# Altium schematic sheet 34_PP1_JTAG, PCIe.SchDoc
size 419 x 296 mm; Author: Serbinov O.A.; CompanyName: ELSICOM; DrawnBy: Serbinov O.A.; Engineer: Serbinov O.A.; Organization: Elsicom; Address1: Kirova avenue, 58; Address2: Tomsk; Address3: Russia 634012; DocumentNumber: 35; SheetNumber: 35; SheetTotal: 44; ProjectName: 48_PORTS
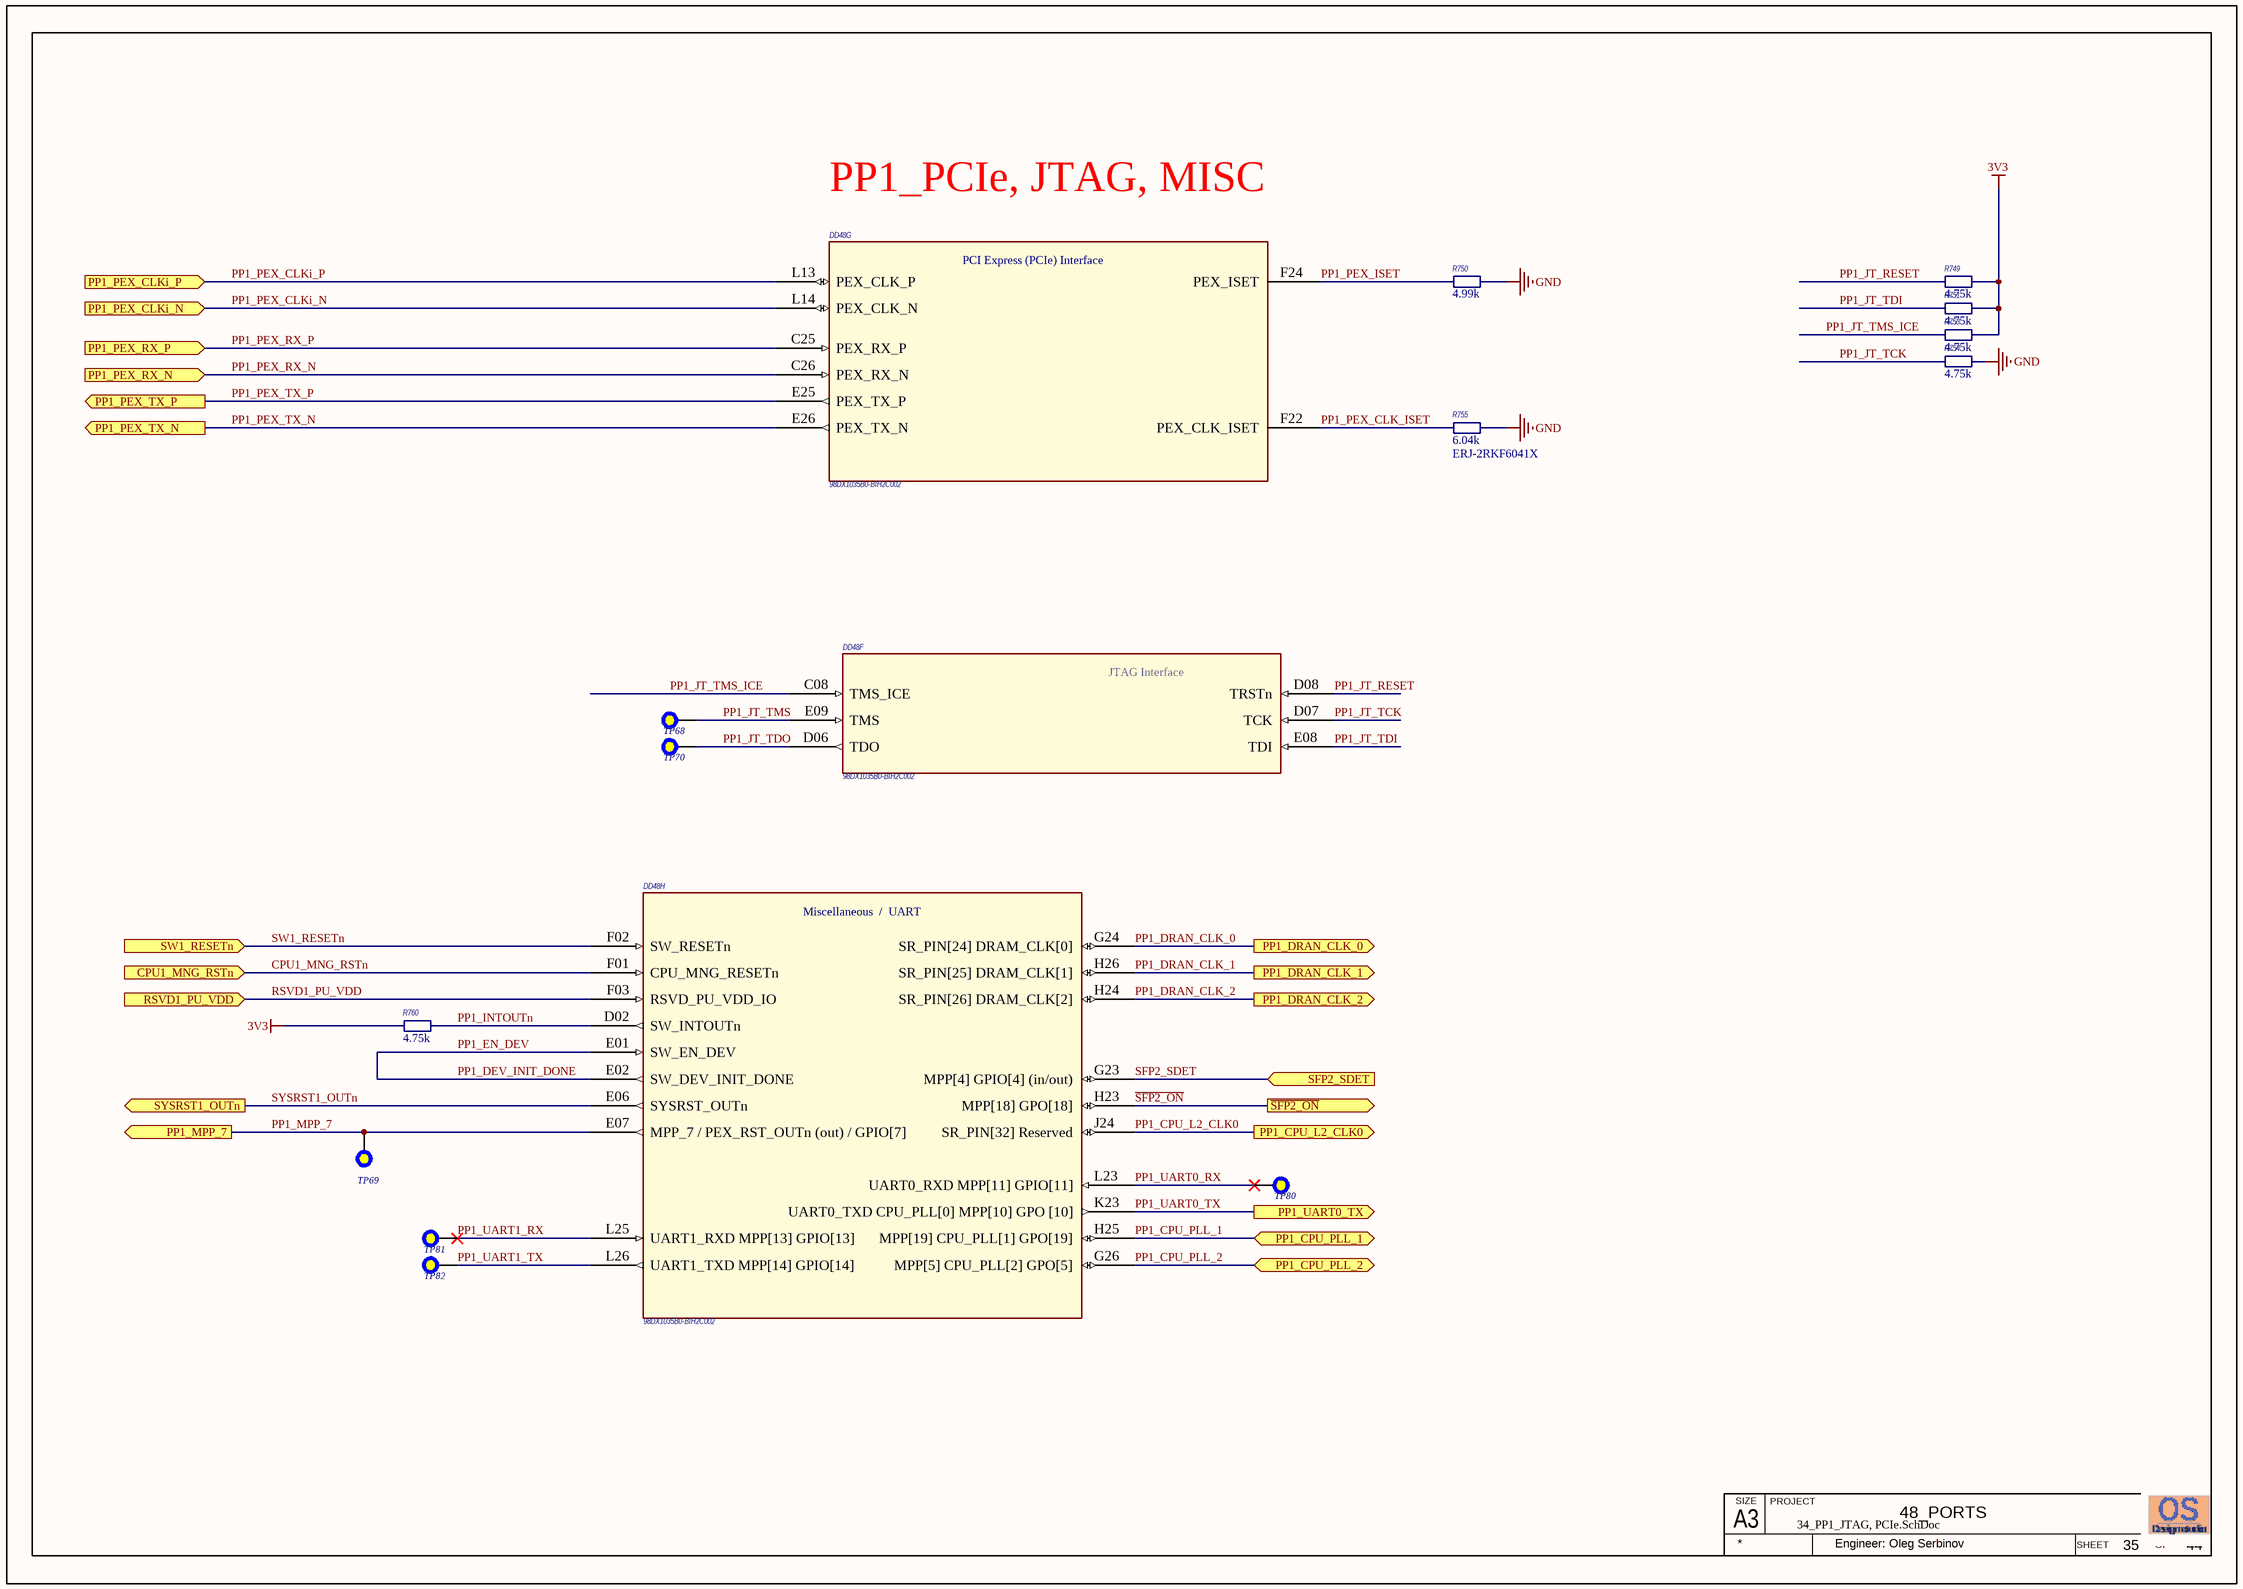
[diagram p0: 34_PP1_JTAG, PCIe.SchDoc]

## Parts
DD48  98DX1035B0-BIH2C002  [HSBGA617_27X27_1MM]  (parts F,G,H of 16)
R749  Resistance (Ohms): 4.75k  [R0402_IPC High Density]  (hidden comment: ERJ-2RKF4751X)
R750  Resistance (Ohms): 4.99k  [R0402_IPC High Density]  (hidden comment: ERJ-2RKF4991X)
R751  Resistance (Ohms): 4.75k  [R0402_IPC High Density]  (hidden comment: ERJ-2RKF4751X)
R753  Resistance (Ohms): 4.75k  [R0402_IPC High Density]  (hidden comment: ERJ-2RKF4751X)
R754  Resistance (Ohms): 4.75k  [R0402_IPC High Density]  (hidden comment: ERJ-2RKF4751X)
R755  Resistance (Ohms): 6.04k  [R0402_IPC High Density]  (hidden comment: ERJ-2RKF6041X)
R760  Resistance (Ohms): 4.75k  [R0402_IPC High Density]  (hidden comment: ERJ-2RKF4751X)
TP68  Test Point 0.5mm pad  [Test Point 0.5mm]  (value not drawn)  (no BOM)
TP69  Test Point 0.5mm pad  [Test Point 0.5mm]  (value not drawn)  (no BOM)
TP70  Test Point 0.5mm pad  [Test Point 0.5mm]  (value not drawn)  (no BOM)
TP80  Test Point 0.5mm pad  [Test Point 0.5mm]  (value not drawn)  (no BOM)
TP81  Test Point 0.5mm pad  [Test Point 0.5mm]  (value not drawn)  (no BOM)
TP82  Test Point 0.5mm pad  [Test Point 0.5mm]  (value not drawn)  (no BOM)

## Ports
CPU1_MNG_RSTn (in), PP1_CPU_L2_CLK0 (out), PP1_CPU_PLL_1 (bidir), PP1_CPU_PLL_2 (bidir), PP1_DRAN_CLK_0 (out), PP1_DRAN_CLK_1 (out), PP1_DRAN_CLK_2 (out), PP1_MPP_7 (out), PP1_PEX_CLKi_N (in), PP1_PEX_CLKi_P (in), PP1_PEX_RX_N (in), PP1_PEX_RX_P (in), PP1_PEX_TX_N (out), PP1_PEX_TX_P (out), PP1_UART0_TX (out), RSVD1_PU_VDD (in), SFP2_SDET (in), SW1_RESETn (in), SYSRST1_OUTn (out), ~{SFP2_ON} (out)

## Nets
3V3: R749.2 R751.2 R753.2 R760.1
GND: R750.2 R754.2 R755.2
~{SFP2_ON}: DD48.H23(MPP[18]_GPO[18]) ; port ~{SFP2_ON}
CPU1_MNG_RSTn: DD48.F01(CPU_MNG_RESETn) ; port CPU1_MNG_RSTn
PP1_CPU_L2_CLK0: DD48.J24(SR_PIN[32]_Reserved) ; port PP1_CPU_L2_CLK0
PP1_CPU_PLL_1: DD48.H25(MPP[19]_CPU_PLL[1]_GPO[19]) ; port PP1_CPU_PLL_1
PP1_CPU_PLL_2: DD48.G26(MPP[5]_CPU_PLL[2]_GPO[5]) ; port PP1_CPU_PLL_2
PP1_DEV_INIT_DONE: DD48.E01(SW_EN_DEV) DD48.E02(SW_DEV_INIT_DONE)  [also labelled PP1_EN_DEV]
PP1_DRAN_CLK_0: DD48.G24(SR_PIN[24]_DRAM_CLK[0]) ; port PP1_DRAN_CLK_0
PP1_DRAN_CLK_1: DD48.H26(SR_PIN[25]_DRAM_CLK[1]) ; port PP1_DRAN_CLK_1
PP1_DRAN_CLK_2: DD48.H24(SR_PIN[26]_DRAM_CLK[2]) ; port PP1_DRAN_CLK_2
PP1_INTOUTn: DD48.D02(SW_INTOUTn) R760.2
PP1_JT_RESET: DD48.D08(TRSTn) R749.1
PP1_JT_TCK: DD48.D07(TCK) R754.1
PP1_JT_TDI: DD48.E08(TDI) R751.1
PP1_JT_TDO: DD48.D06(TDO) TP70.1
PP1_JT_TMS: DD48.E09(TMS) TP68.1
PP1_JT_TMS_ICE: DD48.C08(TMS_ICE) R753.1
PP1_MPP_7: DD48.E07(MPP_7_/_PEX_RST_OUTn_(out)_/_GPIO[7]) TP69.1 ; port PP1_MPP_7
PP1_PEX_CLK_ISET: DD48.F22(PEX_CLK_ISET) R755.1
PP1_PEX_CLKi_N: DD48.L14(PEX_CLK_N) ; port PP1_PEX_CLKi_N
PP1_PEX_CLKi_P: DD48.L13(PEX_CLK_P) ; port PP1_PEX_CLKi_P
PP1_PEX_ISET: DD48.F24(PEX_ISET) R750.1
PP1_PEX_RX_N: DD48.C26(PEX_RX_N) ; port PP1_PEX_RX_N
PP1_PEX_RX_P: DD48.C25(PEX_RX_P) ; port PP1_PEX_RX_P
PP1_PEX_TX_N: DD48.E26(PEX_TX_N) ; port PP1_PEX_TX_N
PP1_PEX_TX_P: DD48.E25(PEX_TX_P) ; port PP1_PEX_TX_P
PP1_UART0_RX: DD48.L23(UART0_RXD_MPP[11]_GPIO[11]) TP80.1
PP1_UART0_TX: DD48.K23(UART0_TXD_CPU_PLL[0]_MPP[10]_GPO_[10]) ; port PP1_UART0_TX
PP1_UART1_RX: DD48.L25(UART1_RXD_MPP[13]_GPIO[13]) TP81.1
PP1_UART1_TX: DD48.L26(UART1_TXD_MPP[14]_GPIO[14]) TP82.1
RSVD1_PU_VDD: DD48.F03(RSVD_PU_VDD_IO) ; port RSVD1_PU_VDD
SFP2_SDET: DD48.G23(MPP[4]_GPIO[4]_(in/out)) ; port SFP2_SDET
SW1_RESETn: DD48.F02(SW_RESETn) ; port SW1_RESETn
SYSRST1_OUTn: DD48.E06(SYSRST_OUTn) ; port SYSRST1_OUTn

## Notes on the sheet
- PP1_PCIe, JTAG, MISC
- A3
- SIZE
- PROJECT
- SHEET
- OF
- Engineer: Oleg Serbinov
- (in symbol 98DX1035A1-BIH2C002, part F) JTAG Interface
- (in symbol 98DX1035A1-BIH2C002, part G) PCI Express (PCIe) Interface
- (in symbol 98DX1035A1-BIH2C002, part H) Miscellaneous  /  UART

## Library data of the parts
DD48 = 98DX1035A1-BIH2C002: IC 24-PORT FE  4-PORT 2.5GE L2 ENTRY-LEVEL, CPU; Customer Part Number: Микросхема, 98DX1035B0-BIH2C002, IC 24-PORT FE 4-PORT 2.5GE L2 ENTRY-LEVEL, HSBGA617SBGA617; Manufacturer: Marvell Technology Group; Manufacturer Part Number: 98DX1035B0-BIH2C002
R749 R751 R753 R754 R760 = ERJ-2RKF4751X: R0402, 4.75k 1%; Manufacturer: Panasonic; Rpart number: RC0402FR-074K75L ; RC1005F4751CS ; RMCF0402FT4K75 ; CRCW04024K75FKED ; TRR01MZPF4751; Rmanufacturer: Yageo  Samsung  Stackpole Electronics  Rohm Semiconductor  Vishay Dale; Customer Part Number: Резистор, 4K75, 0402, 1%; Temperature Coefficient: ±100ppm/°C; Power (Watts): 0.1W, 1/10W; Analogs: any suitable; Tolerance: ±1%; Packaging: Cut Tape (CT); Package / Case: 0402 (1005 Metric); Category: Resistors; Manufacturer Part Number: ERJ-2RKF4751X; Supplier Part Number: P4.75KLCT-ND; RoHS: RoHS Compliant; Supplier: Digi-Key; ComponentLink1URL: http://industrial.panasonic.com/www-cgi/jvcr13pz.cgi?E+PZ+3+AOA0002+ERJ2RKF4751X+7+WW; ComponentLink1Description: http://industrial.panasonic.com/www-cgi/jvcr13pz.cgi?E+PZ+3+AOA0002+ERJ2RKF4751X+7+WW; Features: -; Composition: Thick Film; Height: 0.016" (0.40mm); Number of Terminations: 2; Supplier Device Package: 0402; Size / Dimension: 0.039" L x 0.020" W (1.00mm x 0.50mm)
R750 = ERJ-2RKF4991X: R0402, 4.99k 1%; Manufacturer: Panasonic; Customer Part Number: Резистор, 4K99, 0402, 1%; Description 1: RES 4.99K OHM 1/10W 1% 0402 SMD; Category 1: Resistors; Power (Watts): 0.1W, 1/10W; Temperature Coefficient: ±100ppm/°C; Analogs: any suitable; Supplier 1: Digi-Key; Supplier Part Number 1: P4.99KLTR-ND; RoHS 1: RoHS Compliant; Stock 1: 950000; Pricing 1: 10000=0.00347, 30000=0.00305, 50000=0.00279, 100000=0.00274 (USD); Composition: Thick Film; Features: -; Tolerance: ±1%; Package / Case: 0402 (1005 Metric); Size / Dimension: 0.039" L x 0.020" W (1.00mm x 0.50mm); Height: 0.016" (0.40mm); Number of Terminations: 2; Packaging: Tape & Reel (TR); ComponentLink1URL: http://industrial.panasonic.com/www-cgi/jvcr13pz.cgi?E+PZ+3+AOA0002+ERJ2RKF4991X+7+WW; ComponentLink1Description: http://industrial.panasonic.com/www-cgi/jvcr13pz.cgi?E+PZ+3+AOA0002+ERJ2RKF4991X+7+WW; Supplier Part Number: P4.99KLTR-ND; Manufacturer Part Number: ERJ-2RKF4991X; RoHS: RoHS Compliant; Supplier: Digi-Key; Category: Resistors; Pricing: 10000=0.00347, 30000=0.00305, 50000=0.00279, 100000=0.00274 (USD)
R755 = ERJ-2RKF6041X: R0402, 6.04k 1%; Manufacturer: Panasonic; Rpart number: RC0402FR-076K04L ; RC1005F6041CS ; RMCF0402FT6K04 ; CRCW04026K04FKED ; TRR01MZPF6041 ; RC-02W6041FT; Rmanufacturer: Yageo  Samsung  Stackpole Electronics  Rohm Semiconductor  Vishay Dale; Customer Part Number: Резистор, 6K04, 0402, 1%; Description 1: RES 6.04K OHM 1/10W 1% 0402 SMD; Category 1: Resistors; Power (Watts): 0.1W, 1/10W; Temperature Coefficient: ±100ppm/°C; Analogs: any suitable; Tolerance: ±1%; Supplier 1: Digi-Key; Supplier Part Number 1: P6.04KLCT-ND; RoHS 1: RoHS Compliant; Stock 1: 566346; Pricing 1: 1=0.1, 50=0.0242, 100=0.0184, 250=0.01364, 500=0.01008, 1000=0.00672, 5000=0.00473 (USD); Composition: Thick Film; Features: -; Package / Case: 0402 (1005 Metric); Size / Dimension: 0.039" L x 0.020" W (1.00mm x 0.50mm); Height: 0.016" (0.40mm); Number of Terminations: 2; Packaging: Cut Tape (CT); ComponentLink1URL: http://industrial.panasonic.com/www-cgi/jvcr13pz.cgi?E+PZ+3+AOA0002+ERJ2RKF6041X+7+WW; ComponentLink1Description: http://industrial.panasonic.com/www-cgi/jvcr13pz.cgi?E+PZ+3+AOA0002+ERJ2RKF6041X+7+WW; RoHS: RoHS Compliant; Supplier Part Number: P6.04KLCT-ND; Category: Resistors; Supplier: Digi-Key; Pricing: 1=0.1, 50=0.0242, 100=0.0184, 250=0.01364, 500=0.01008, 1000=0.00672, 5000=0.00473 (USD); Manufacturer Part Number: ERJ-2RKF6041X